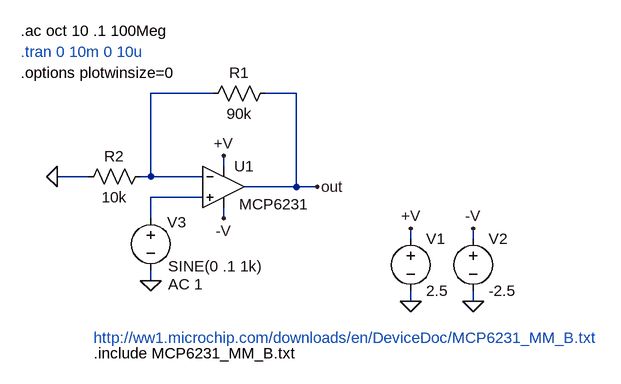
[diagram p0: schematic MCP6231_test.asc]
MCP6231_test.asc, the LTspice schematic file:
Version 4
SHEET 1 2580 1112
WIRE 64 64 -32 64
WIRE 192 64 144 64
WIRE 80 176 80 160
WIRE -128 192 -176 192
WIRE -32 192 -32 64
WIRE -32 192 -48 192
WIRE 48 192 -32 192
WIRE 192 208 192 64
WIRE 192 208 112 208
WIRE 224 208 192 208
WIRE 48 224 -32 224
WIRE -32 256 -32 224
WIRE 80 256 80 240
WIRE 368 288 368 272
WIRE 464 288 464 272
WIRE -32 352 -32 336
WIRE 368 384 368 368
WIRE 464 384 464 368
FLAG 464 384 0
FLAG 368 384 0
FLAG 368 272 +V
FLAG 464 272 -V
FLAG -32 352 0
FLAG 80 160 +V
FLAG 80 256 -V
FLAG -176 192 0
FLAG 224 208 out
SYMBOL voltage 368 272 R0
SYMATTR InstName V1
SYMATTR Value 2.5
SYMBOL voltage 464 272 R0
SYMATTR InstName V2
SYMATTR Value -2.5
SYMBOL voltage -32 240 R0
WINDOW 0 25 22 Left 0
WINDOW 3 27 90 Left 0
WINDOW 123 27 118 Left 0
WINDOW 39 0 0 Left 0
SYMATTR InstName V3
SYMATTR Value SINE(0 .1 1k)
SYMATTR Value2 AC 1
SYMBOL opamps\\UniversalOpamp 80 208 R0
WINDOW 38 24 27 Left 0
SYMATTR SpiceModel MCP6231
SYMATTR InstName U1
SYMATTR Value2 ""
SYMATTR SpiceLine ""
SYMATTR SpiceLine2 ""
SYMBOL res 48 80 R270
WINDOW 0 32 56 VTop 0
WINDOW 3 0 56 VBottom 0
SYMATTR InstName R1
SYMATTR Value 90k
SYMBOL res -144 208 R270
WINDOW 0 32 56 VTop 0
WINDOW 3 0 56 VBottom 0
SYMATTR InstName R2
SYMATTR Value 10k
TEXT -232 -32 Left 0 !.ac oct 10 .1 100Meg
TEXT -120 440 Left 0 ;http://ww1.microchip.com/downloads/en/DeviceDoc/MCP6231_MM_B.txt
TEXT -120 464 Left 0 !.include MCP6231_MM_B.txt
TEXT -232 0 Left 0 ;.tran 0 10m 0 10u
TEXT -232 32 Left 0 !.options plotwinsize=0

The netlist it stands for:
* MCP6231_test.asc
V1 +V 0 2.5
V2 -V 0 -2.5
V3 N002 0 SINE(0 .1 1k) AC 1
XU1 N002 N001 +V -V out MCP6231  ; pins In+ In- V+ V- OUT
R1 N001 out 90k
R2 0 N001 10k
.ac oct 10 .1 100Meg
* http://ww1.microchip.com/downloads/en/DeviceDoc/MCP6231_MM_B.txt
.include MCP6231_MM_B.txt
* .tran 0 10m 0 10u
.options plotwinsize=0
.lib UniversalOpAmp1.lib
.backanno
.end